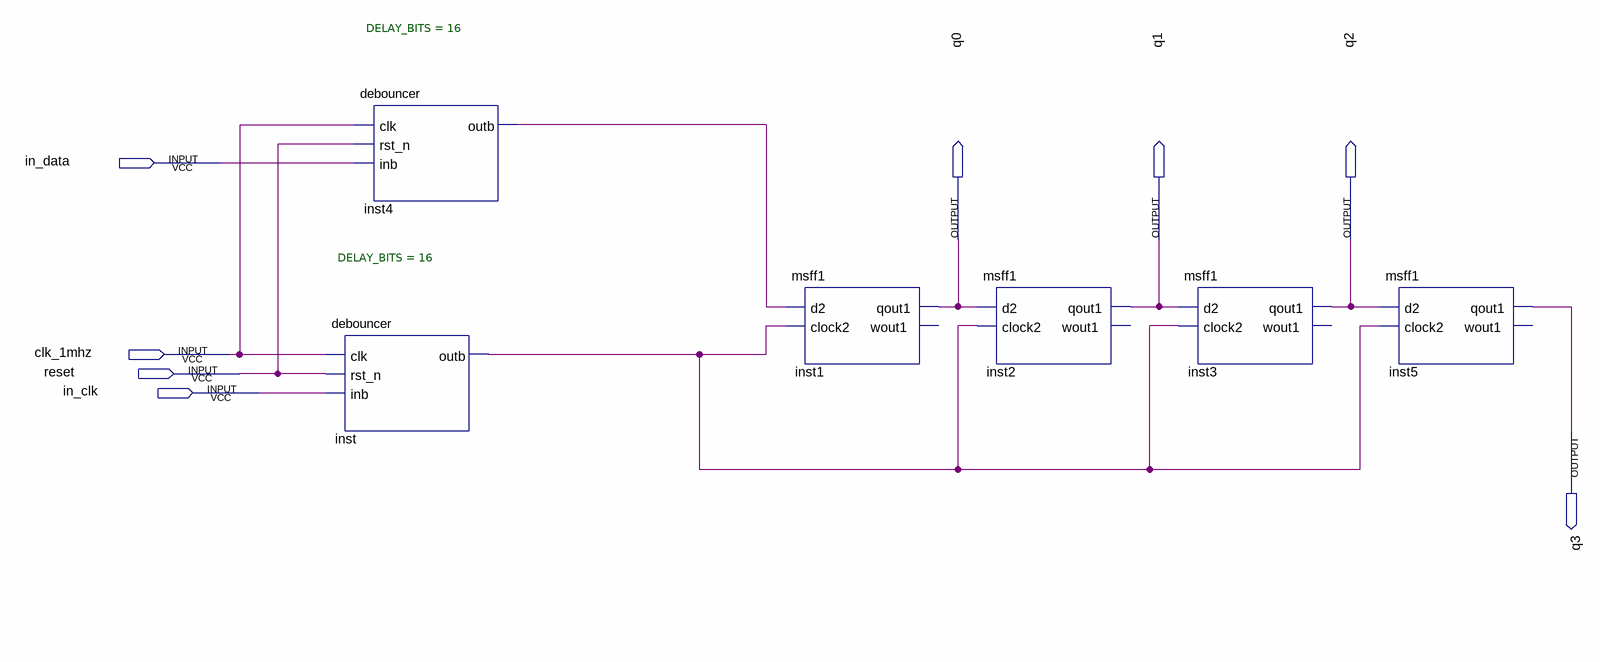
[diagram p0: schematic sheet]
// Quartus schematic registrador.bdf as structural Verilog: 6 symbols, 8 pins
module registrador (
  input  in_data,
  input  clk_1mhz,
  input  reset,
  input  in_clk,
  output q0,
  output q1,
  output q2,
  output q3
);

  wire inst4_outb, inst_outb;

  debouncer #(.DELAY_BITS(16)) inst (.clk(clk_1mhz), .rst_n(reset), .inb(in_clk), .outb(inst_outb));
  debouncer #(.DELAY_BITS(16)) inst4 (.clk(clk_1mhz), .rst_n(reset), .inb(in_data), .outb(inst4_outb));
  msff1 inst1 (.d2(inst4_outb), .clock2(inst_outb), .qout1(q0));  // open: wout1
  msff1 inst2 (.d2(q0), .clock2(inst_outb), .qout1(q1));  // open: wout1
  msff1 inst3 (.d2(q1), .clock2(inst_outb), .qout1(q2));  // open: wout1
  msff1 inst5 (.d2(q2), .clock2(inst_outb), .qout1(q3));  // open: wout1
endmodule
